# EAGLE design moscow_esp8266_revb (EAGLE 6.6.0)

## Sheet 1 of 2
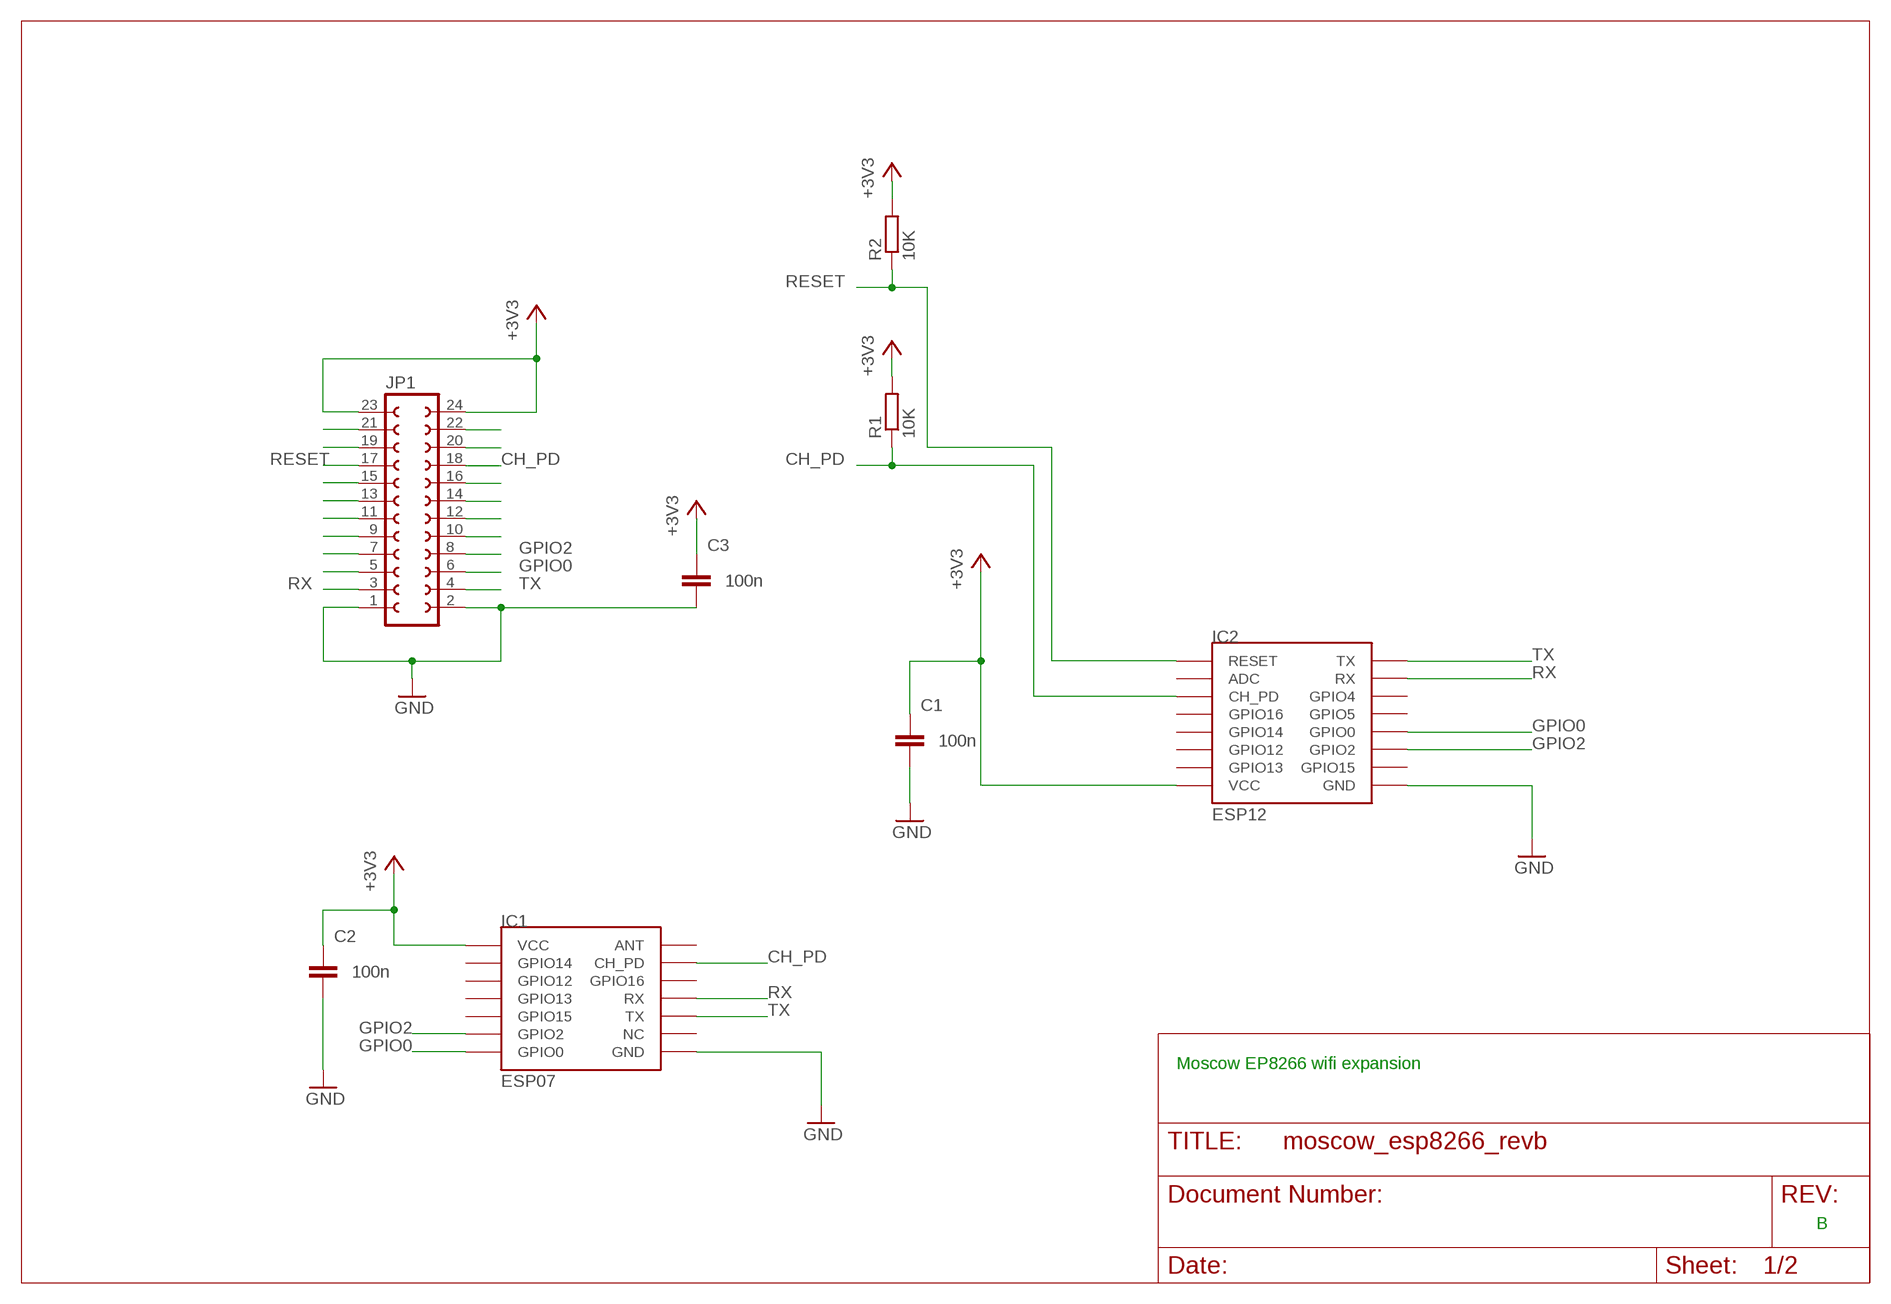
[diagram p0: schematic, sheet 1]

### Parts
C1  100n  C-EUC0805  [C0805]
C2  100n  C-EUC0805  [C0805]
C3  100n  C-EUC0805  [C0805]
IC1  ESP07  [ESP07]
IC2  ESP12  [ESP12]
JP1  FE12-2  [FE12-2]
R1  10K  R-EU_R0805  [R0805]
R2  10K  R-EU_R0805  [R0805]

### Nets
+3V3: C1.1 C2.1 C3.1 IC1.VCC IC2.VCC JP1.23 JP1.24 R1.2 R2.2
CH_PD: IC1.CH_PD IC2.CH_PD JP1.18 R1.1
GND: C1.2 C2.2 C3.2 IC1.GND IC2.GND JP1.1 JP1.2
GPIO0: IC1.GPIO0 IC2.GPIO0 JP1.6
GPIO2: IC1.GPIO2 IC2.GPIO2 JP1.8
N$5: JP1.14
N$9: JP1.22
N$10: JP1.20
N$11: JP1.7
N$12: JP1.16
N$13: JP1.5
N$14: JP1.12
N$15: JP1.10
N$21: JP1.21
N$22: JP1.19
N$24: JP1.15
N$25: JP1.13
N$26: JP1.11
N$27: JP1.9
RESET: IC2.RESET JP1.17 R2.1
RX: IC1.RX IC2.RX JP1.3
TX: IC1.TX IC2.TX JP1.4
Unconnected: IC1.ANT IC1.GPIO12 IC1.GPIO13 IC1.GPIO14 IC1.GPIO15 IC1.GPIO16 IC1.NC IC2.ADC IC2.GPIO4 IC2.GPIO5 IC2.GPIO12 IC2.GPIO13 IC2.GPIO14 IC2.GPIO15 IC2.GPIO16

### Notes on the sheet
- Moscow EP8266 wifi expansion
- B

## Sheet 2 of 2
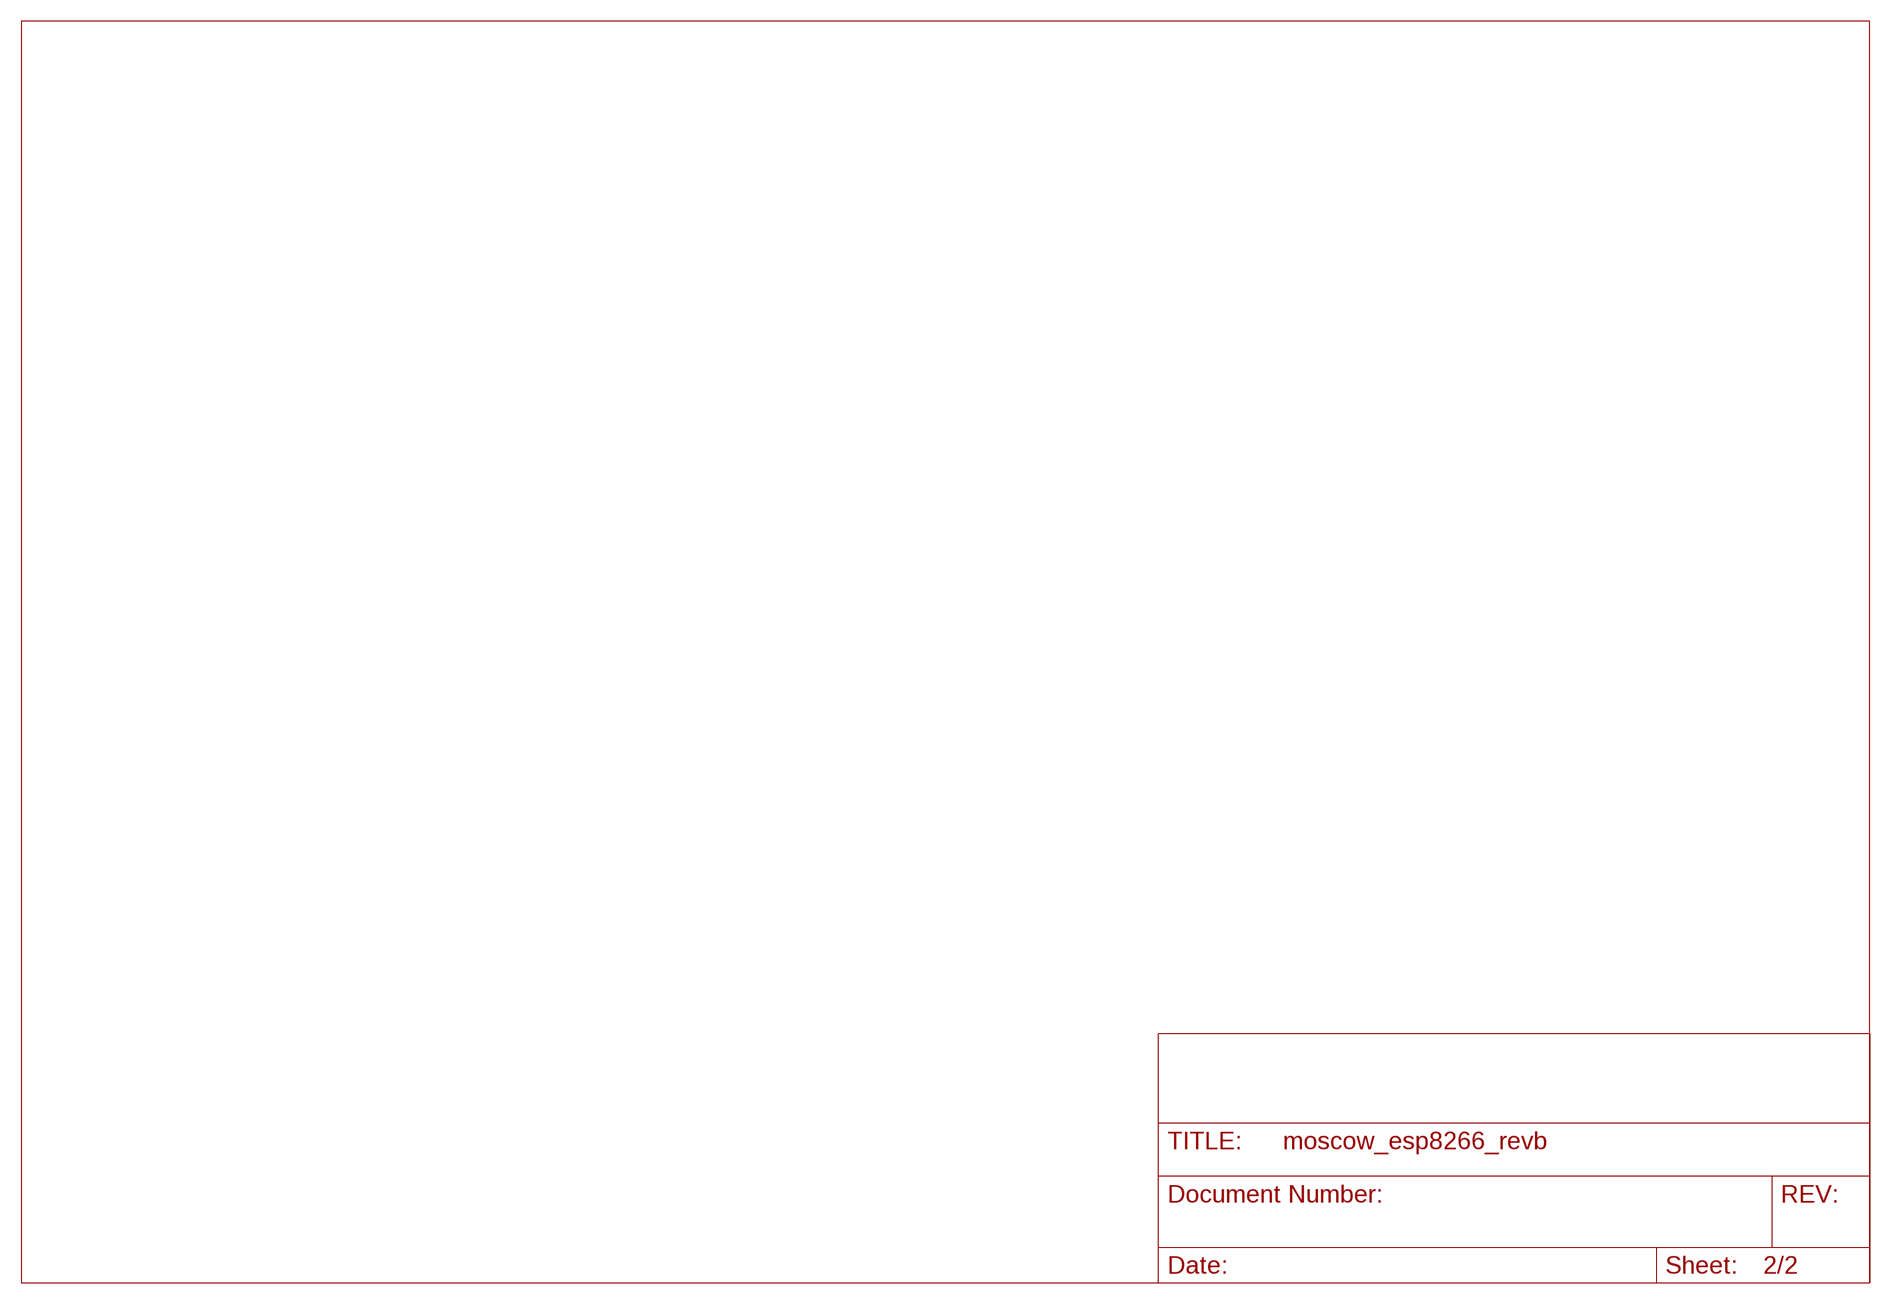
[diagram p1: schematic, sheet 2]

## Library data of the parts
C1-C3 = rcl:C-EU: CAPACITOR, European symbol
IC1 = esp8266modules:ESP07: ESP8266 Wifi module 07 & 08
IC2 = esp8266modules:ESP12: ESP8266 Wifi module 12
JP1 = con-lsta:FE12-2: FEMALE HEADER; OC_FARNELL: unknown; OC_NEWARK: unknown
R1 R2 = rcl:R-EU_: RESISTOR, European symbol

## Board
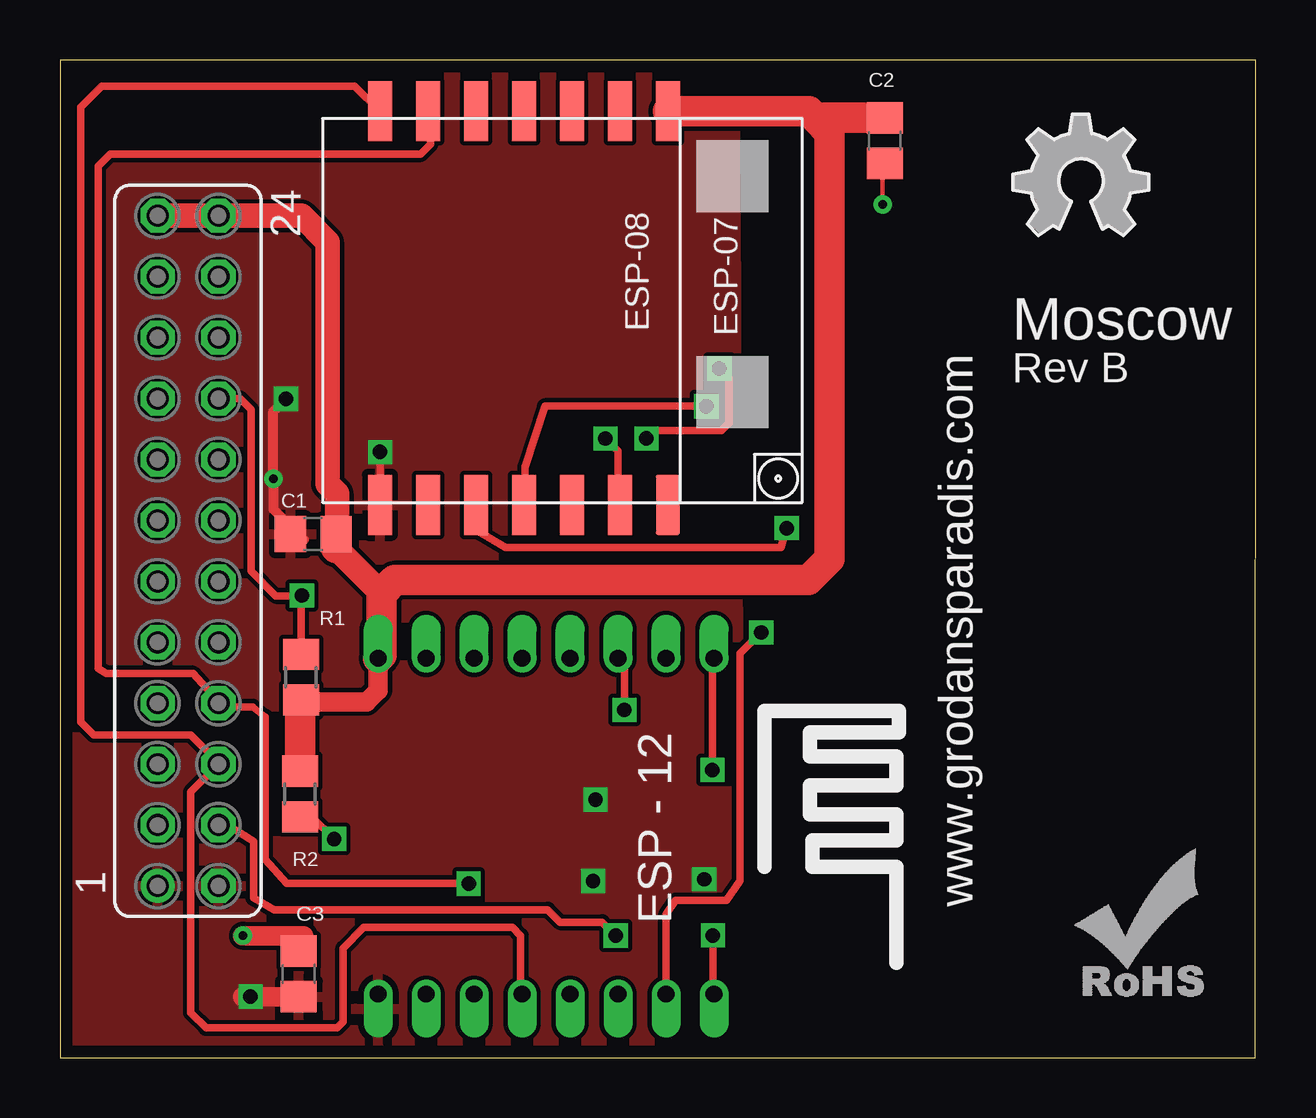
[diagram p2: board, top side]
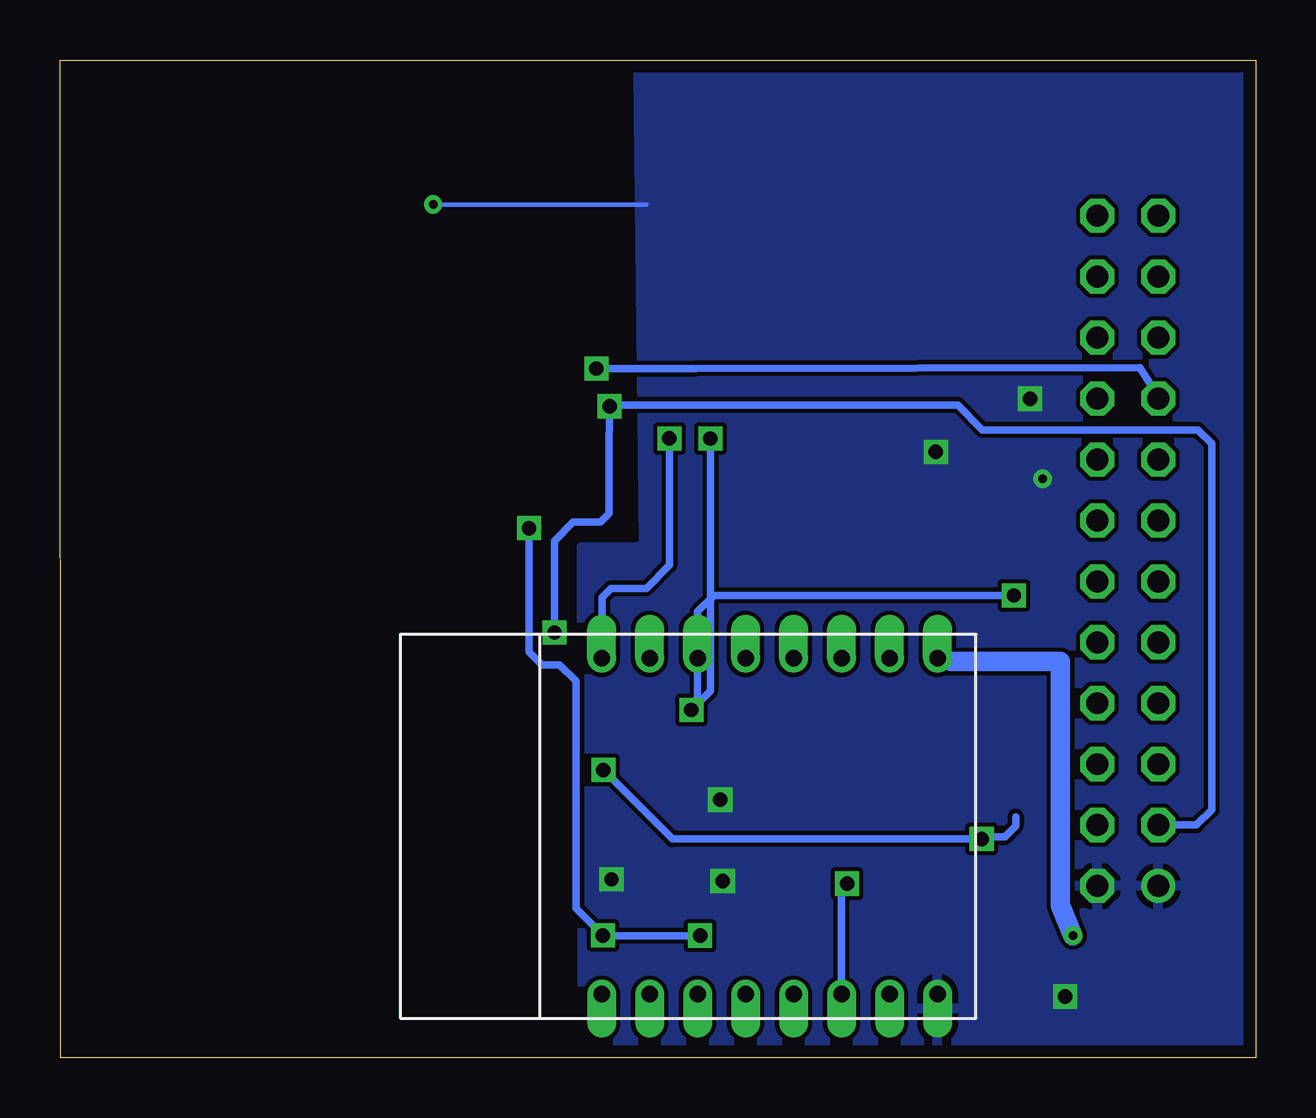
[diagram p3: board, bottom side, seen from below]

Size 49.84 x 41.59 mm. Coordinates in mm from the lower left corner, seen from the top.
Outline: 0,0 49.81,0 49.84,41.59 0,41.58 0,0
Copper layers (1*16): Top 0.0356mm / dielectric 1.5011mm / Bottom 0.0356mm
Design rules "SilverCircuits": minimum track width 7mil, minimum drill 14mil, track to track 7mil, track to pad 7mil, pad to pad 7mil, via to via 7mil, smd to smd 0mil, copper to edge 20mil, drill to drill 8mil, minimum pad ring 10mil, minimum via ring 8mil, stop-mask expansion 4mil, vias tented up to drill 0mil, thermal gap 10mil

### Footprints (pad centres in the part's own frame; a part is rotated, then mirrored left to right if it is on the bottom)
C0805 = smd 1.3 x 1.5: 1 -0.95,0; 2 0.95,0
ESP07 = smd 2.5 x 1: ANT 8.2,6.8; CH_PD 8.2,4.8; GND 8.2,-5.2; GPIO0 -8.2,-5.2; GPIO2 -8.2,-3.2; GPIO12 -8.2,2.8; GPIO13 -8.2,0.8; GPIO14 -8.2,4.8; GPIO15 -8.2,-1.2; GPIO16 8.2,2.8; NC 8.2,-3.2; RX 8.2,0.8; TX 8.2,-1.2; VCC -8.2,6.8
ESP12 = drill 0.7 offset: ADC -7.1,3.8; CH_PD -7.1,1.8; GND 6.9,-8.2; GPIO0 6.9,-2.2; GPIO2 6.9,-4.2; GPIO4 6.9,1.8; GPIO5 6.9,-0.2; GPIO12 -7.1,-4.2; GPIO13 -7.1,-6.2; GPIO14 -7.1,-2.2; GPIO15 6.9,-6.2; GPIO16 -7.1,-0.2; RESET -7.1,5.8; RX 6.9,3.8; TX 6.9,5.8; VCC -7.1,-8.2
FE12-2 = drill 0.914: 1 -13.97,1.27 | drill 0.914 octagon: 2 -13.97,-1.27; 3 -11.43,1.27; 4 -11.43,-1.27; 5 -8.89,1.27; 6 -8.89,-1.27; 7 -6.35,1.27; 8 -6.35,-1.27; 9 -3.81,1.27; 10 -3.81,-1.27; 11 -1.27,1.27; 12 -1.27,-1.27; 13 1.27,1.27; 14 1.27,-1.27; 15 3.81,1.27; 16 3.81,-1.27; 17 6.35,1.27; 18 6.35,-1.27; 19 8.89,1.27; 20 8.89,-1.27; 21 11.43,1.27; 22 11.43,-1.27; 23 13.97,1.27; 24 13.97,-1.27
R0805 = smd 1.3 x 1.5: 1 -0.95,0; 2 0.95,0

### Placement (x,y rotation side)
C1  10.56,21.82 180 top
C2  34.38,38.22 270 top
C3  9.95,3.49 270 top
IC1  18.54,31.24 270 top
IC2  21.46,9.55 270 top
JP1  5.34,21.12 90 top
R1  10.04,15.86 270 top
R2  10,10.99 90 top
U$1  [OSHW_FILLX200_NOTEXT]  39.72,34.25 0 top
U$2  [ROHS_SILK]  44.39,4.97 0 top

### Tracks (layer width: path | path; a pad name or v marks a point on that pad's centre or on a via)
+3V3  (via drill 0.36)
  Top 0.178: 10.16,5.08 C3.1
  Top 0.813: JP1.24 JP1.23 | 11.54,21.86 C1.1 | IC2.VCC 13.27,15.31 12.78,14.83 10.12,14.83 R1.2 | v7.62,5.08 10.16,5.08
  Top 1.016: 11.51,21.25 13.4,19.35 | JP1.23 10.06,35.09 11.16,34 11.16,23.91 11.54,23.52 11.54,21.86
  Top 1.27: IC1.VCC 31.21,39.44 31.48,39.17 | 31.48,39.17 32.08,38.58 32.08,20.79 31.19,19.9 13.95,19.9 13.4,19.35 13.4,16.79 IC2.VCC | C1.1 11.51,21.25 | C2.1 31.48,39.17 | R2.2 10,14.87 R1.2
  Bottom 0.178: 12.7,16.51 IC2.VCC
  Bottom 0.813: v7.62,5.08 8.14,6.35 8.14,16.51 12.7,16.51
CH_PD  (via drill 0.6)
  Top 0.305: IC1.CH_PD 23.27,22.97 23.27,25.27 v22.73,25.81 | R1.1 10.04,19.22 v10.08,19.26 v10.07,19.25 9,19.25 7.97,20.28 7.97,27.01 7.51,27.47 JP1.18 | v23.53,14.49 23.53,16.39 IC2.CH_PD
  Bottom 0.305: v10.08,19.26 22.59,19.26 23.27,18.59 23.27,14.76 v23.53,14.49 22.73,15.29 v22.73,25.81
GND  (via drill 0.36, 0.6)
  Top 0.178: 10.16,21.59 C1.2 | v34.29,35.56 34.29,36.83 C2.2 | 10.16,2.54 C3.2 | 7.62,2.54 v7.94,2.54
  Top 0.305: v13.34,25.25 IC1.GND
  Top 0.406: 10.16,21.59 8.89,22.86 v8.89,24.13 8.89,26.94 v9.41,27.46
  Top 0.813: 7.62,2.54 10.16,2.54
  Bottom 0.178: 25.4,35.56 v34.29,35.56
  other vias: 22.22,7.36 26.85,7.43 22.32,10.75
  pour Bottom: 0.28,41.29 0.25,41.29 0.25,0.09 24.44,0.38 28.06,0.43 28.09,21.29 25.8,21.29 25.49,21.38 25.73,41.13 0.51,41.37 0.51,40.95
  pour Top: -0.55,37.93 -0.45,-2.79 28.32,-2.79 28.38,-1 28.14,42.2 -0.16,42.14 -0.54,42.02
GPIO0
  Top 0.305: IC2.GPIO0 19.2,2.71 19.2,5.09 18.87,5.42 12.67,5.42 11.81,4.56 11.81,1.5 11.54,1.23 6.09,1.23 5.46,1.87 5.46,11.07 6.61,12.22 JP1.6 6.61,12.3 5.45,13.46 1.4,13.46 0.87,13.99 0.87,39.63 1.74,40.5 12.28,40.5 IC1.GPIO0
GPIO2  (via drill 0.6)
  Top 0.305: v17.04,7.25 9.45,7.25 8.56,8.26 8.56,14.21 8.03,14.62 6.76,14.62 JP1.8 6.61,14.82 5.54,16.01 1.93,16.01 1.59,16.23 1.59,37.16 2.09,37.66 15.04,37.66 15.44,38.07 15.44,39.34 IC1.GPIO2
  Bottom 0.305: IC2.GPIO2 17.27,7.03 v17.04,7.25
N$1
  pour Top: 27.89,21.29 25.41,21.29 25.41,21.21
RESET  (via drill 0.6)
  Top 0.305: R2.1 10.5,10.04 v11.43,9.11 | v27.19,11.99 27.19,16.58 IC2.RESET | v24.44,25.81 24.44,25.82 24.77,26.15 27.57,26.15 27.88,26.45 27.88,28.33 v27.48,28.72
  Bottom 0.305: v27.19,11.99 24.32,9.11 v11.43,9.11 11.34,9.2 10.47,9.2 10,9.66 R2.1 | JP1.17 4.07,27.56 4.83,28.75 23.35,28.72 v27.48,28.72 | v24.44,25.81 24.44,20.53 25.41,19.56 26.87,19.56 27.24,19.19 27.24,16.67 IC2.RESET
RX  (via drill 0.6)
  Top 0.305: IC2.RX 25.27,5.96 25.66,6.55 27.78,6.55 28.34,7.38 28.34,16.84 v29.23,17.72 | v26.93,27.15 20.21,27.15 19.39,24.62 19.39,23.09 IC1.RX
  Bottom 0.305: v29.23,17.72 29.23,21.54 28.45,22.32 27.32,22.32 26.96,22.67 26.96,25.04 v26.93,27.15 26.88,27.2 12.42,27.2 11.39,26.17 2.42,26.17 1.84,25.59 1.84,10.32 2.47,9.69 JP1.3
TX  (via drill 0.6)
  Top 0.305: IC1.TX 17.34,22 18.58,21.26 30.04,21.26 v30.29,22.07 | v27.21,5.09 27.21,2.7 IC2.TX | JP1.4 6.94,9.73 8.07,9.01 8.07,6.65 8.93,6.17 20.32,6.17 20.85,5.65 22.6,5.65 v23.16,5.09
  Bottom 0.305: v30.29,22.07 30.29,16.91 29.76,16.38 29.02,16.38 28.34,15.71 28.34,6.23 v27.21,5.09 v27.2,5.09 v23.16,5.09

### Text on the board
tNames: Moscow | Rev B | www.grodansparadis.com